# EAGLE design untitled (EAGLE 9.5.1)
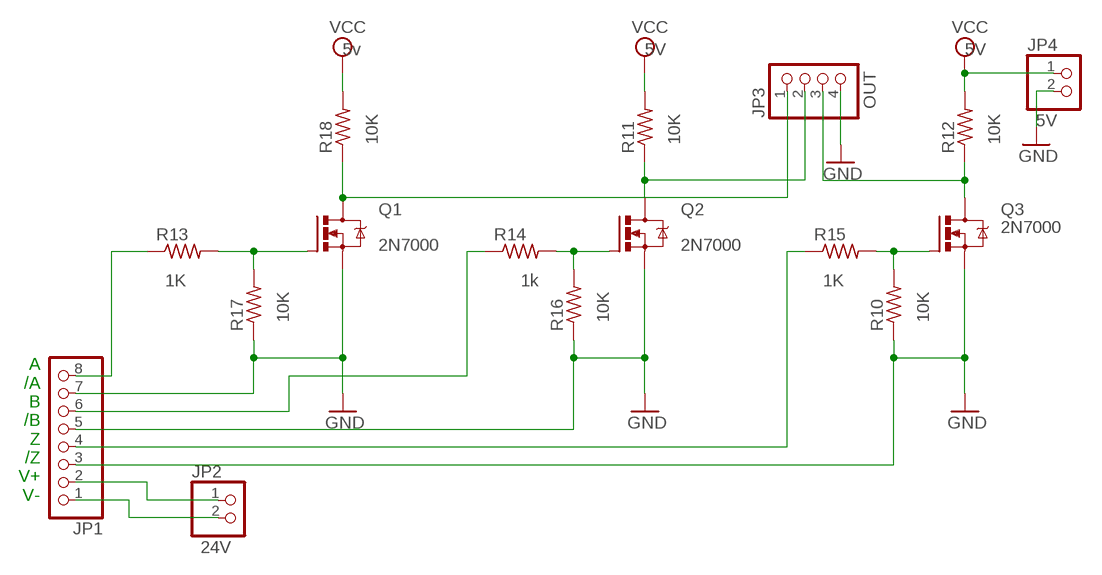
[diagram p0: schematic, sheet 1]

## Parts
JP1  PINHD-1X8  [1X08]
JP2  PINHD-1X2  [1X02]
JP3  PINHD-1X4  [1X04]
JP4  PINHD-1X2  [1X02]
Q1  IRF540  [TO220BV]
Q2  IRF540  [TO220BV]
Q3  IRF540  [TO220BV]
R10  R-US_M0805  [M0805]
R11  R-US_M0805  [M0805]
R12  R-US_M0805  [M0805]
R13  R-US_M0805  [M0805]
R14  R-US_M0805  [M0805]
R15  R-US_M0805  [M0805]
R16  R-US_M0805  [M0805]
R17  R-US_M0805  [M0805]
R18  R-US_M0805  [M0805]

## Nets
GND: JP1.3 JP1.5 JP1.7 JP3.4 JP4.2 Q1.S Q2.S Q3.S R10.1 R16.1 R17.1
N$1: JP3.3 Q3.D R12.1
N$2: Q3.G R10.2 R15.2
N$3: JP3.2 Q2.D R11.1
N$4: Q2.G R14.2 R16.2
N$5: Q1.G R13.2 R17.2
N$6: JP3.1 Q1.D R18.1
N$7: JP1.8 R13.1
N$9: JP1.6 R14.1
N$11: JP1.4 R15.1
N$13: JP1.2 JP2.1
N$14: JP1.1 JP2.2
VCC: JP4.1 R11.2 R12.2 R18.2

## Notes on the sheet
- A
  /A
  B
  /B
  Z
  /Z
  V+
  V-

## Library data of the parts
JP1 = pinhead:PINHD-1X8: PIN HEADER
JP2 JP4 = pinhead:PINHD-1X2: PIN HEADER
JP3 = pinhead:PINHD-1X4: PIN HEADER; OUT: out
Q1-Q3 = transistor-power:IRF540: HEXFET Power MOSFET
R10-R12 R16 R17 = rcl:R-US_: RESISTOR, American symbol; SPICEPREFIX: R
R13 R15 = rcl:R-US_: RESISTOR, American symbol; SPICEPREFIX: 1K
R14 = rcl:R-US_: RESISTOR, American symbol; SPICEPREFIX: 1k
R18 = rcl:R-US_: RESISTOR, American symbol; 10K: 10K; SPICEPREFIX: R

## Board
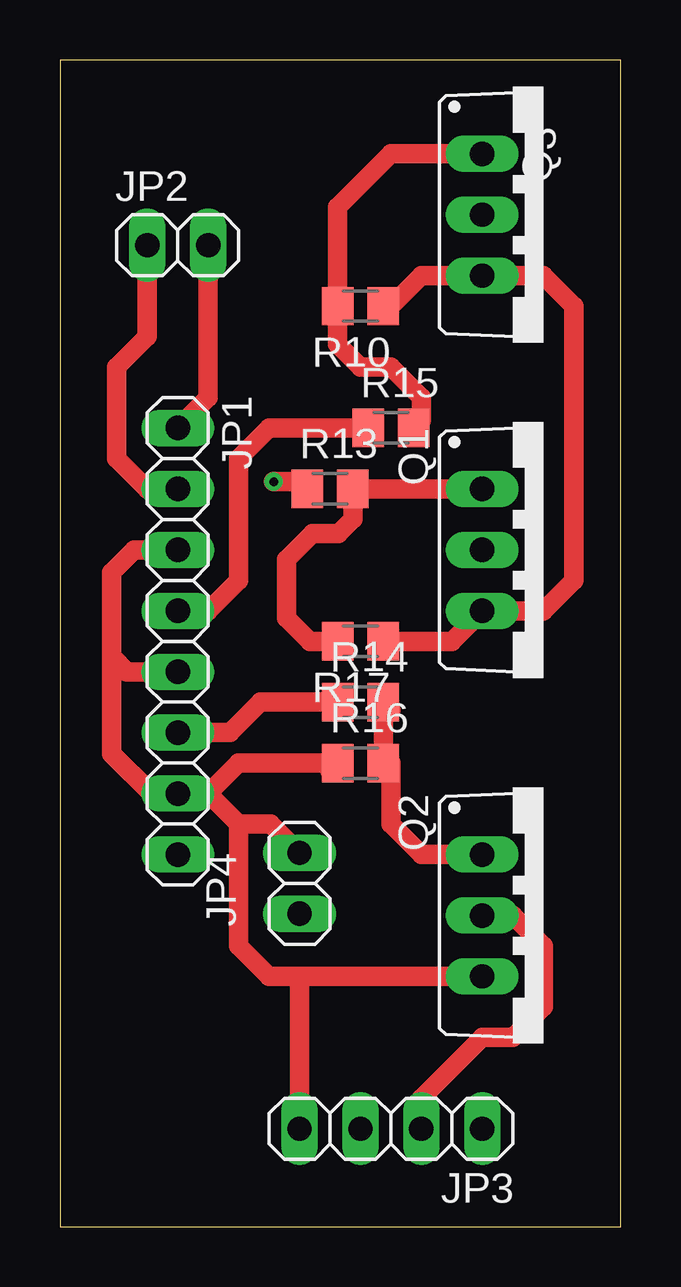
[diagram p1: board, top side]
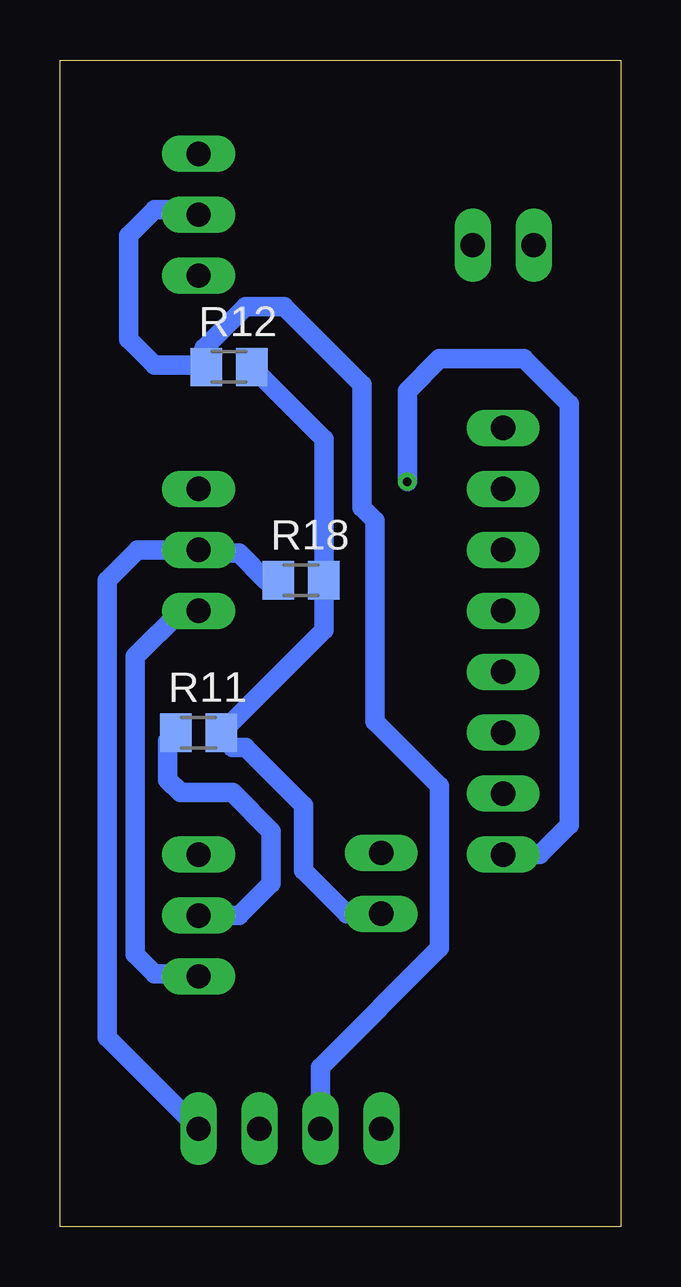
[diagram p2: board, bottom side, seen from below]

Size 23.39 x 48.63 mm. Coordinates in mm from the lower left corner, seen from the top.
Outline: 0,0 23.39,0 23.39,48.63 0,48.63 0,0
Copper layers (1*16): Top 0.035mm / dielectric 1.5mm / Bottom 0.035mm
Design rules "default": minimum track width 6mil, minimum drill 0.35mm, track to track 6mil, track to pad 6mil, pad to pad 6mil, via to via 6mil, smd to smd 6mil, copper to edge 40mil, drill to drill 6mil, minimum pad ring 10mil, minimum via ring 8mil, stop-mask expansion 4mil, vias tented up to drill 0mil, thermal gap 10mil

### Footprints (pad centres in the part's own frame; a part is rotated, then mirrored left to right if it is on the bottom)
1X08 = drill 1.016 long: 1 -8.89,0; 2 -6.35,0; 3 -3.81,0; 4 -1.27,0; 5 1.27,0; 6 3.81,0; 7 6.35,0; 8 8.89,0
1X02 = drill 1.016 long: 1 -1.27,0; 2 1.27,0
1X04 = drill 1.016 long: 1 -3.81,0; 2 -1.27,0; 3 1.27,0; 4 3.81,0
TO220BV = drill 1.016 long: D 0,-2.54; G -2.54,-2.54; S 2.54,-2.54
M0805 = smd 1.3 x 1.6: 1 -0.95,0; 2 0.95,0

### Placement (x,y rotation side)
JP1  4.91,24.4 270 top
JP2  4.91,40.91 0 top
JP3  13.8,4.08 180 top
JP4  9.99,14.31 90 top
Q1  20.15,28.21 270 top
Q2  20.15,12.97 270 top
Q3  20.15,42.18 270 top
R10  12.53,38.37 180 top
R11  17.61,20.59 0 bottom
R12  16.34,35.83 0 bottom
R13  11.26,30.75 0 top
R14  12.53,21.86 0 top
R15  13.8,33.29 0 top
R16  12.53,19.32 0 top
R17  12.53,24.4 180 top
R18  13.34,26.94 0 bottom

### Tracks (layer width: path | path; a pad name or v marks a point on that pad's centre or on a via)
GND
  Top 0.813: 11.26,19 R16.1 7.45,19.32 6.18,18.05 | Q2.S 9.99,10.43 | 9.99,10.43 8.72,10.43 7.45,11.7 7.45,16.78 | 7.45,16.78 6.18,18.05 | 6.18,18.05 JP1.7 3.82,18.05 2.16,19.71 2.16,23.76 | JP3.4 9.99,10.43 | R17.1 16.34,24.4 Q1.S 20.15,25.67 21.42,26.94 21.42,38.37 20.15,39.64 Q3.S 15.07,39.64 13.8,38.37 R10.1 | JP1.3 3.1,28.21 2.16,27.27 2.16,23.76 | JP1.5 2.79,23.13 2.16,23.76 | JP4.2 8.79,16.78 7.45,16.78
  Bottom 0.813: Q2.S 17.71,10.53 19.44,10.53 20.25,11.34 20.25,23.76 18.34,25.67 Q1.S
N$1
  Bottom 0.813: 17.29,41.86 Q3.D 17.82,42.39 19.44,42.39 20.52,41.31 20.52,36.99 19.44,35.91 17.37,35.91 | R12.1 17.37,35.91 | 17.37,35.91 17.37,36.63 15.66,38.34 14.04,38.34 10.8,35.1 10.8,29.97 10.26,29.43 10.26,21.06 7.56,18.36 7.56,11.61 12.53,6.64 JP3.3
N$2
  Top 0.813: Q3.G 13.8,44.72 11.58,42.5 R10.2 11.58,36.78 12.53,35.83 13.8,35.83 15.07,34.56 15.07,33.61 R15.2
N$3
  Top 0.813: Q2.D 18.88,12.97 20.15,11.7 20.15,9.16 18.88,7.89 17.61,7.89 15.07,5.35 JP3.2
  Bottom 0.813: 18.36,12.96 Q2.D 15.92,12.97 14.58,14.31 14.58,16.47 16.2,18.09 18.36,18.09 18.9,18.63 18.9,20.25 R11.1
N$4
  Top 0.813: 13.8,21.54 R14.2 R16.2 13.8,19.32 13.8,16.78 15.07,15.51 Q2.G
N$5
  Top 0.813: R17.2 10.43,24.4 9.45,25.38 9.45,27.81 10.53,28.89 11.61,28.89 12.21,29.49 R13.2 Q1.G
N$6
  Bottom 0.813: JP3.1 21.42,7.89 21.42,26.94 20.15,28.21 Q1.D 17.48,28.08 15.93,28.08 14.79,26.94 R18.1
N$7  (via drill 0.35)
  Top 0.813: v8.91,31.05 10.01,31.05 R13.1
  Bottom 0.813: JP1.8 3.39,15.51 2.16,16.74 2.16,34.29 4.05,36.18 7.56,36.18 8.91,34.83 v8.91,31.05
N$9
  Top 0.813: R14.1 8.36,21.86 7.09,20.59 JP1.6
N$11
  Top 0.813: R15.1 8.72,33.29 7.45,32.02 7.45,26.94 6.18,25.67 JP1.4
N$13
  Top 0.813: JP2.1 3.64,37.1 2.37,35.83 2.37,32.02 3.64,30.75 JP1.2
N$14
  Top 0.813: JP1.1 6.18,34.56 JP2.2
VCC
  Bottom 0.813: R12.2 12.39,32.83 R18.2 12.39,24.86 R11.2 16.66,20.44 16.2,19.98 15.66,19.98 13.23,17.55 13.23,14.85 11.42,13.04 JP4.1